# Altium schematic sheet PowerInjector.SchDoc
size A
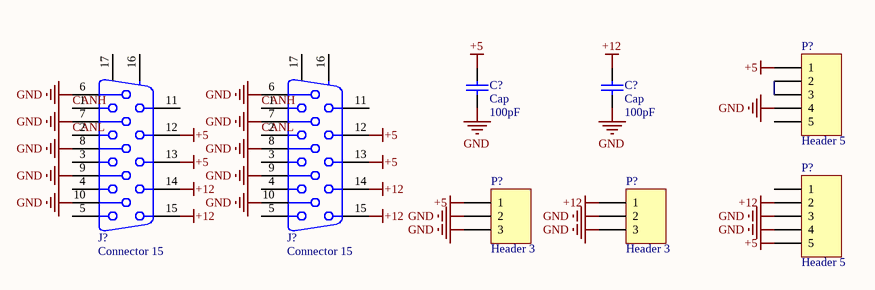
[diagram p0: PowerInjector.SchDoc]

## Parts
(Parts that share a designator on the sheet are numbered #1, #2 ... from top to bottom, then left to right.)
C?#1  Cap  value 100pF  [RAD-0.3]
C?#2  Cap  value 100pF  [RAD-0.3]
J?#1  Connector 15  [050DSUB0.762-4H15]
J?#2  Connector 15  [050DSUB0.762-4H15]
P?#1  Header 5  [HDR1X5]
P?#2  Header 5  [HDR1X5]
P?#3  Header 3  [HDR1X3]
P?#4  Header 3  [HDR1X3]

## Nets
+5: C?#1.2 J?#1.12 J?#1.13 J?#2.12 J?#2.13 P?#1.1 P?#2.5 P?#3.1
+12: C?#2.2 J?#1.14 J?#1.15 J?#2.14 J?#2.15 P?#2.2 P?#4.1
GND: C?#1.1 C?#2.1 J?#1.6 J?#1.7 J?#1.8 J?#1.9 J?#1.10 J?#2.6 J?#2.7 J?#2.8 J?#2.9 J?#2.10 P?#1.4 P?#2.3 P?#2.4 P?#3.2 P?#3.3 P?#4.2 P?#4.3
CANH: J?#1.1 J?#2.1
CANL: J?#1.2 J?#2.2
NetP?#1_2: P?#1.2 P?#1.3

Not connected (* = marked no-connect by the designer): J?#1 3 4 5 11 16(MH1) 17(MH2); J?#2 3 4 5 11 16(MH1) 17(MH2); P?#1 5; P?#2 1

## Library data of the parts
C?#1 C?#2 = Cap: Capacitor; Published: 8-Jun-2000; LatestRevisionDate: 17-Jul-2002; LatestRevisionNote: Re-released for DXP Platform.; PackageReference: RAD-0.3; Publisher: Altium Limited; PackageDescription: Radial Cap, Thru-Hole; 2 Leads; 0.3 in Pin Spacing
J?#1 J?#2 = Connector 15: Receptacle Assembly, 15-Pin, Sim Line Connector; PackageDocument: B; Positions: 15; Gender: Receptacle Header; Published: 15-Jun-2001; LatestRevisionDate: 17-Jul-2002; LatestRevisionNote: Re-released for DXP Platform.; DatasheetDocument: 24-Nov-1999; PackageReference: 788574; Publisher: Altium Limited; Orientation: Right Angle
P?#1 P?#2 = Header 5: Header, 5-Pin; LatestRevisionDate: 17-Jul-2002; LatestRevisionNote: Re-released for DXP Platform.; Publisher: Altium Limited
P?#3 P?#4 = Header 3: Header, 3-Pin; LatestRevisionDate: 17-Jul-2002; LatestRevisionNote: Re-released for DXP Platform.; Publisher: Altium Limited